# Altium schematic sheet B3F-1000S.SchDoc
size A; SheetNumber: 1; SheetTotal: 1
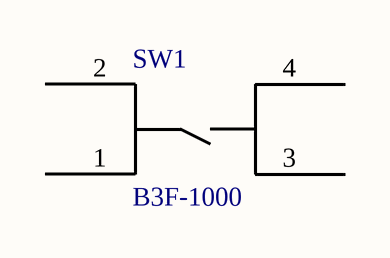
[diagram p0: B3F-1000S.SchDoc]

## Parts
SW1  B3F-1000  [PCBComponent_1]

## Nets

Not connected (* = marked no-connect by the designer): SW1 1(P1) 2(P2) 3(P3) 4(P4)

## Library data of the parts
SW1 = B3F-1000S